# Altium schematic sheet PH.SchDoc
size A; SheetNumber: 5; SheetTotal: 5; SPICEModelCacheLCDKWDOD: <root> / <DocumentId>LCDKWDOD</DocumentId> / <CacheFrame Number="0"> / <Model Name="umk107bj105_a-t" Kind="CKT"> / <Text>* UMK107BJ105_A-T     SPICE MODEL  ( General Type ) / *-------------------------------------------------------------------------------------------------------- / * Model Generated by TAIYO YUDEN Corporation (http://www.ty-top.com) / * Version 1.0 / * TAIYO YUDEN Control No. 170508_130520 / * Copyright(c) 2012 TAIYO YUDEN CO.,LTD. All Rights Reserved. / *-------------------------------------------------------------------------------------------------------- / * / * Products Name : Multilayer Ceramic Capacitors / * / * Characteristics : / *     Capacitance : 1 uF , Rated Voltage : 50V , TCC : X5R / *     Case Size : 1.6 x 0.8 / 0.063 x 0.031 [mm/inch] , Thickness : 0.8 / 0.031 [mm/inch] / *     (Conditions: Temperature = 25 degC , DC Bias Current/Voltage = 0A / 0V) / * / * Frequency Range : 40Hz - 3GHz / * / * External Node Assignments : / * / *  1  o---| |---o  2 / * / *-------------------------------------------------------------------------------------------------------- / .SubCkt UMK107BJ105_A-T 1 2 / **************************** / C0 1 110 0.79929u / Cm 1 101 0.13681u / C1 101 102 0.26224u / Rc1 101 102 5.8806k / C2 102 103 0.057839u / Rc2 102 103 469.42 / C3 103 110 0.014568u / Rc3 103 110 14.853 / C2m 1 301 0.13283u / C21 301 302 1.2593u / Rc21 301 302 6.3079k / C22 302 303 1.1189u / Rc22 302 303 6.9405k / C23 303 304 1.1421u / Rc23 303 304 6.4848k / C24 304 305 0.36861u / Rc24 304 305 785 / C25 305 306 0.39327u / Rc25 305 306 637.41 / C26 306 307 0.27451u / Rc26 306 307 19.365 / C27 307 308 0.15295u / Rc27 307 308 23.239 / C28 308 309 0.17569u / Rc28 308 309 17.788 / C29 309 110 1420.6p / Rc29 309 110 1.9725 / Rp0 1 110 500Meg / L0 110 120 0.24088n / Lm 120 130 0.1369n / L1 120 121 0.1842n / RL1 121 130 0.29804 / L2 120 122 0.40657n / RL2 122 130 0.57395 / L3 120 123 0.85773n / RL3 123 130 0.82282 / CR 120 124 0.11463u / LR 124 125 0.25983n / RR 125 130 52.447m / CL 130 140 1.4637p / LL 130 140 0.23986n / RL 130 140 33.985 / Rs 140 2 6.8539m / **************************** / .ends UMK107BJ105_A-T</Text> / </Model> / </CacheFrame> / </root>
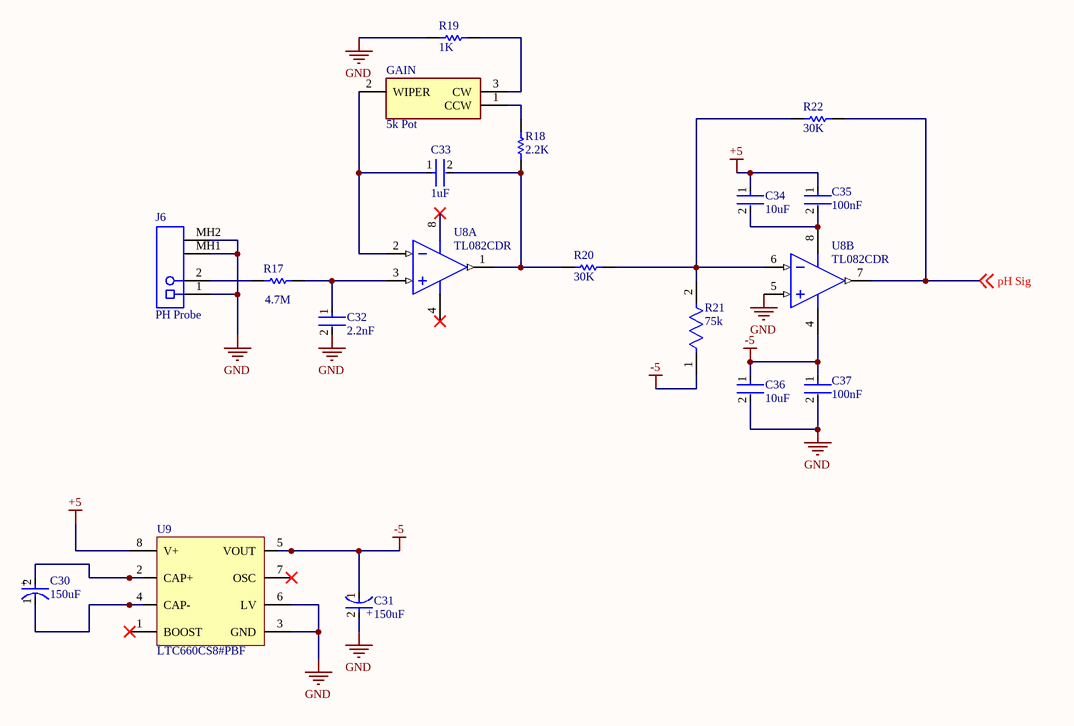
[diagram p0: PH.SchDoc]

## Parts
C30  150uF  [FP-POSCAP-D3L-MFG]
C31  150uF  [FP-POSCAP-D3L-MFG]
C32  2.2nF  [FP-GRM188-0_1-e0_2_0_5-MFG]
C33  1uF  [FP-0603-L_1_6_0_1-W_0_8_0-IPC_A]
C34  10uF  [FP-C0805C-DG-MFG]
C35  100nF  [FP-CGA3E-0_3-0_1-IPC_A]
C36  10uF  [FP-C0805C-DG-MFG]
C37  100nF  [FP-CGA3E-0_3-0_1-IPC_A]
GAIN  5k Pot  [3296Y1502LF]
J6  PH Probe  [TECO-1-1337543-0_V]
R17  4.7M  [RESC1609X50X30LL10T20]
R18  2.2K  [RESC1608X55X30ML20T20]
R19  1K  [RESC2013X50X30NL20T20]
R20  30K  [RESC1609X50X30LL10T20]
R21  75k  [FP-ERA3A-MFG]
R22  30K  [RESC1609X50X30LL10T20]
U8  TL082CDR  [D0008A_N]  (parts A,B of 2)
U9  LTC660CS8#PBF  [LT-S8-8_L]

## Nets
+5: C34.1 C35.1 U9.8(V+)
-5: C31.1(C) C36.1 C37.1 R21.1 U8.4(VCC-) U9.5(VOUT)
GND: C31.2(A) C32.2 C36.2 C37.2 J6.1 J6.MH1 J6.MH2 R19.2 U8.5(IN2+) U9.3(GND) U9.6(LV)
pH Sig: R22.2 U8.7(OUT2) ; off-sheet pH Sig
NetC30_1: C30.1(C) U9.4(CAP-)
NetC30_2: C30.2(A) U9.2(CAP+)
NetC32_1: C32.1 R17.2 U8.3(IN1+)
NetC33_1: C33.1 GAIN.2(WIPER) U8.2(IN1-)
NetC33_2: C33.2 R18.1 R20.1 U8.1(OUT1)
NetC34_2: C34.2 C35.2 U8.8(VCC+)
NetGAIN_1: GAIN.1(CCW) R18.2
NetGAIN_3: GAIN.3(CW) R19.1
NetJ6_2: J6.2 R17.1
NetR20_2: R20.2 R21.2 R22.1 U8.6(IN2-)

Not connected (* = marked no-connect by the designer): U9 1(BOOST)* 7(OSC)*

## Notes on the sheet
- (in symbol CMP-05428-001128-1) +

## Library data of the parts
C30 C31 = CMP-05428-001128-1: Molded Tantalum Polymer Capacitor 150uF 20% 10V life 2000Hours SMD 2917; ESR (Equivalent Series Resistance): 15mR; Dissipation Factor: 10%; Polarity: Polar; Ripple Current: 3.6A; Leakage Current: 150uA; Tolerance: 20%; Voltage Rating: 10V; Height: 2.8mm; Case Code (Metric): 7343; Max Operating Temperature: 105°C; Features: General Purpose; Construction: Flat; Mount: Surface Mount; REACH SVHC: No SVHC; Packaging: Tape and Reel; Termination: SMD/SMT; Lead Free: Lead Free; Case Code (Imperial): 2917; Voltage: 10V; Min Operating Temperature: -55°C; Capacitance: 150uF; Series: POSCAP™ TPF; Length: 7.3mm; Radiation Hardening: No; Width: 4.3mm; RoHS Compliant: Yes; Package Quantity: 2500; Case/Package: 2917; Height - Seated (Max): 0.118inch; Depth: 4.3mm; Voltage Rating (DC): 10V
C32 = CMP-06035-056041-1: Chip Multilayer Ceramic Capacitors for General Purpose, 0603, 2200pF, C0G, 30ppm/°C, 5%, 50V; Insulation Resistance: 10GR; Min Operating Temperature: -55°C; Voltage: 50V; Tolerance: 5%; Height: 0.8mm; Packaging: Tape and Reel; Length: 1.6mm; Mount: Surface Mount; Temperature Coefficient: 30ppm/°C; Case Code (Metric): 1608; Case/Package: 0603; Lead Free: Lead Free; Voltage Rating: 50V; Termination: SMD/SMT; Max Operating Temperature: 125°C; Voltage Rating (DC): 50V; Number of Pins: 2; Dielectric: C0G; Material: Ceramic; Thickness: 0.035inch; REACH SVHC: No SVHC; Dielectric Material: Ceramic; Case Code (Imperial): 0603; Radiation Hardening: No; Package Quantity: 1; Capacitance: 2.2nF; Width: 0.8mm; Depth: 0.8mm
C33 = CMP-2000-05447-3: None; Tolerance: 10%; Voltage Rating: 50V; Dielectric: X5R; Height: 0.8mm; Depth: 0.8mm; Number of Pins: 2; Length: 1.6mm; Thickness: 0.035inch; Contact Plating: Nickel; Radiation Hardening: No; Package Quantity: 1; Case/Package: 0603; Capacitance: 1uF; Halogen Free: Halogen Free; RoHS Compliant: Yes; Termination: SMD/SMT; Max Operating Temperature: 85°C; Min Operating Temperature: -55°C; Case Code (Metric): 1608; Construction: Flat; Voltage Rating (DC): 50V; Packaging: Tape and Reel; Series: M; Case Code (Imperial): 0603; Width: 0.031inch; Mount: Surface Mount
C34 C36 = CMP-2007-03243-2: CAP CER 10UF 10V X5R 0805; Manufacturer Part Number: C0805C106K8PACTU; Manufacturer: Kemet; 3DS Part Number: 220-00001; Tolerance: 10%; Temperature Coefficient: 15%; Material: Ceramic; Device Class L2: Capacitors; Device Class L1: Passive Components; ComponentLink2URL: https://content.kemet.com/datasheets/KEM_C1006_X5R_SMD.pdf; Height: 1.4mm; Lead Free: Yes; Digikey Description: CAP CER 10UF 10V X5R 0805; Octopart: https://octopart.com/c0805c106k8pactu-kemet-98697; Capacitance: 10uF; Value: 10uF; Temperature Range Low: -55°C; Temperature: -55°C to +85°C; Automotive: No; Mouser Description: CAP CER 10UF 10V X5R 0805; Ipc Land Pattern Name: CAPC200125X125; Temperature Range High: +85°C; Voltage: 10V; RoHS: TRUE; Device Class L3: Ceramic Capacitors; ComponentLink2Description: Datasheet; Voltage Rating: 10V; Package: C0805C-DG; Temperature Characteristic: X5R; Category: Cap
C35 C37 = CMP-2000-07546-2: Cap Ceramic 100nF 50V X7R 10% Pad SMD 0603 +125°C Automotive T/R; Weight: 7.1E-05oz; Composition: Ceramic; Max Operating Temperature: 125°C; Termination: SMD/SMT; Dielectric: X7R; Length: 1.6mm; Package Quantity: 1; REACH SVHC: No SVHC; Lead Free: Lead Free; Case Code (Metric): 1608; Min Operating Temperature: -55°C; Packaging: Tape and Reel; Tolerance: 10%; Voltage Rating: 50V; Case Code (Imperial): 0603; Capacitance: 100nF; Case/Package: 0603; Voltage Rating (DC): 50V; Depth: 0.8mm; Radiation Hardening: No; Ratings: AEC-Q200; Mount: Surface Mount; Voltage: 50V; Thickness: 0.035inch; Width: 0.8mm; Height: 0.8mm
GAIN = 3296Y-1-502LF: Variable Resistor; Manufacturer_Name: Bourns; Datasheet Link: http://uk.rs-online.com/web/p/products/5220215; Height: 10.03mm; Manufacturer_Part_Number: 3296Y-1-502LF; Mouser Part Number: 652-3296Y-1-502LF; Mouser Price/Stock: https://www.mouser.co.uk/ProductDetail/Bourns/3296Y-1-502LF?qs=T7l%2FPuJnbcQ857qUhxMrRA%3D%3D; Arrow Part Number: 3296Y-1-502LF; Arrow Price/Stock: https://www.arrow.com/en/products/3296y-1-502lf/bourns?region=europe
J6 = CMP-2000-05853-1: Female Connector, Pitch 2.54 mm, 1 x 2 Position, Height 15.8 mm, Tail Length 3.8 mm, / -55 to 85 degC, RoHS, Bulk; Manufacturer: TE Connectivity; Connector Body Style: RightAngleJack; Frequency Max: 4GHz; Coaxial Termination: Solder; Connector Mounting: PCBMount; SVHC: ToBeAdvised; Connector Type: BNCCoaxial; Impedance: 50ohm; Coaxial Cable Types: -; Manufacturer URL: http://www.te.com/; Package Reference: 1-1337543-0; Product Range: -; Datasheet URL: http://www.te.com/commerce/DocumentDelivery/DDEController?Action=showdoc&DocId=Customer+Drawing%7F1337543%7FG%7Fpdf%7FEnglish%7FENG_CD_1337543_G.pdf%7F1-1337543-0; Contact Plating: GoldPlatedContacts; Mounting Technology: ThroughHole; Package Description: Female Connector, Pitch 2.54 mm, 1 x 2 Position, Height 15.8 mm, Tail Length 3.8 mm; Contact Material: Brass; Datasheet Version: Rev. G, 12/2012
R17 = CMP-2000-03425-1: Manufacturer: Vishay Dale; Part Number: CRCW06034M70FKEA
R18 = CMP-2000-00955-1: Manufacturer: Panasonic; Part Number: ERA3AEB222V
R19 = CMP-1013-00510-2: Part Number: CRCW08051K00FKEA; Manufacturer: Vishay Dale
R20 R22 = CMP-2000-03223-1: Part Number: CRCW060330K0FKEA; Manufacturer: Vishay Dale
R21 = CMP-2000-00124-2: RES SMD 75K OHM 0.1% 1/10W 0603; Manufacturer: Panasonic; Manufacturer Part Number: ERA-3AEB753V; Voltage Rating: 75V; Resistance: 75kΩ; Power Rating: 0.1W; Automotive Grade: Grade 0; Value: 75kΩ; Temperature Coefficient: 25ppm/°C; Ipc Land Pattern Name: RESC16080X45; Device Class L3: Chip SMD Resistors; Composition: Metal Film; Footprint Url: https://industrial.panasonic.com/cdbs/www-data/pdf/RDM0000/DMM0000COL17.pdf; Temperature: -55°C to +155°C; Automotive: Yes; Lead Free: Yes; Device Class L2: Resistors; Package: ERA3A; Octopart: https://octopart.com/era-3aeb753v-panasonic-1225046; Device Class L1: Passive Components; ComponentLink2Description: Datasheet; Temperature Range Low: -55°C; Series: ERA; ComponentLink2URL: https://industrial.panasonic.com/cdbs/www-data/pdf/RDM0000/AOA0000C307.pdf; RoHS: TRUE; Temperature Range High: +155°C; Category: Res; Height: 0.55mm; Digikey Description: RES SMD 75K OHM 0.1% 1/10W 0603; Tolerance: 0.1%; Mouser Description: Thin Film Resistors - SMD 0603 1/10W 75Kohms
U8 = CMP-0017-00394-2: JFET-Input Operational Amplifier, 7 to 36 V, 0 to 70 degC, 8-pin SOIC (D8), Green (RoHS & no Sb/Br); Manufacturer: Texas Instruments; Total Supply Voltage(Min)(+5V is 5, +/-5V is 10): 7; Iq per channel(Max)(mA): 2.8; Total Supply Voltage(Max)(+5V is 5, +/-5V is 10): 36; GBW(Typ)(MHz): 3; Number of Channels: 2; IIB(Max)(pA): 400; CMRR(Min)(dB): 70; Offset Drift(Typ)(uV/C): 18; Rating: Catalog; Vio (25C)(Max)(mV): 15; Sub Family: General Purpose Amplifier, High Supply Voltage Amplifier (>=30V); Slew Rate(Typ)(V/us): 13; ComponentLink3Description: Package Specification; PackageReference: D0008A; Mounting Technology: Surface Mount; Code_JEDEC: MS-012; ComponentLink1URL: http://www.ti.com/; ComponentLink2URL: http://www.ti.com/lit/ds/symlink/tl082.pdf; DatasheetVersion: SLOS081G; PartNumber: TL082CDR; PackageVersion: 4040047-3/M, 06/2011; ComponentLink1Description: Manufacturer URL; Eco-Plan: Green (RoHS & no Sb/Br); Vn at 1kHz(Typ)(nV/rtHz): 18; ComponentLink2Description: Datasheet; PackageDescription: 8-Pin Plastic Small Outline, Body 4.9 x 3.9 mm, Pitch 1.27 mm; ComponentLink3URL: http://www.ti.com/litv/pdf/msoi002j
U9 = CMP-0475-00376-1: 100 mA CMOS Voltage Converter, 1.5 to 5.5 V Vin, 8-pin SOIC (S8-8), 0 to 70 degC, Pb-Free; Manufacturer: Linear Technology; Frequency(kHz): 80; Vin Min(V): 1.5; Ishutdown(uA): 1; Voutput: -VIN, 2VIN; Isupply(mA): 0.23; Vin Max(V): 5.5; ComponentLink1Description: Manufacturer URL; PackageVersion: Rev. G, 03/2012; PackageReference: S8-8; PartNumber: LTC660CS8#PBF; ComponentLink2Description: Datasheet; PackageDescription: 8-Pin Plastic Small Outline (Narrow .150 Inch), Body 4.9 x 3.9 mm, Pitch 1.27 mm; ComponentLink2URL: http://cds.linear.com/docs/en/datasheet/660fa.pdf; ComponentLink3URL: http://cds.linear.com/docs/en/packaging/05081610_G_SO8.pdf; Mounting Technology: Surface Mount; ComponentLink3Description: Package Specification; ComponentLink1URL: http://www.linear.com/; RoHS: TRUE; DatasheetVersion: Rev. A